# EAGLE design RFID (EAGLE 6.4)
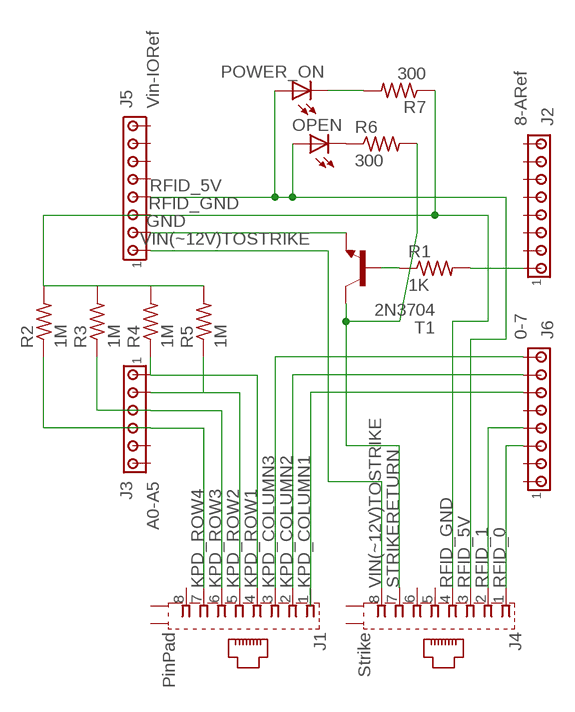
[diagram p0: schematic, sheet 1]

## Parts
J1  PinPad  556591-1  [556591-1]
J2  8-ARef  MTA08-156  [1X8MTA]
J3  A0-A5  MTA06-100  [10X06MTA]
J4  Strike  556591-1  [556591-1]
J5  Vin-IORef  MTA08-156  [1X8MTA]
J6  0-7  MTA08-156  [1X8MTA]
OPEN  LED3MM  [LED3MM]
POWER_ON  LED3MM  [LED3MM]
R1  1K  R-US_0204/5  [0204/5]
R2  1M  R-US_0204/5  [0204/5]
R3  1M  R-US_0204/5  [0204/5]
R4  1M  R-US_0204/5  [0204/5]
R5  1M  R-US_0204/5  [0204/5]
R6  300  R-US_0204/5  [0204/5]
R7  300  R-US_0204/5  [0204/5]
T1  2N3704  [TO92]

## Nets
GND: J5.2 T1.3(E)
KPD_COLUMN1: J6.6
KPD_COLUMN2: J1.2 J6.7
KPD_COLUMN3: J1.3 J6.8
KPD_ROW1: J1.4 J3.6 R4.1
KPD_ROW2: J1.5 J3.5 R5.1
KPD_ROW3: J1.6 J3.4 R3.1
KPD_ROW4: J1.7 J3.3 R2.1
N$1: J2.1 R1.2
N$2: R1.1 T1.1(B)
N$3: OPEN.K(C) R6.1
N$4: POWER_ON.K(C) R7.2
RFID_0: J4.1 J6.3
RFID_1: J4.2 J6.4
RFID_5V: J4.3 J5.4 OPEN.A POWER_ON.A
RFID_GND: J4.4 J5.3 R2.2 R3.2 R4.2 R5.2 R7.1
STRIKERETURN: J4.7 R6.2 T1.2(C)
VIN(~12V)TOSTRIKE: J4.8 J5.1
Unconnected: J1.1 J1.8 J1.G1(S1) J1.G2(S2) J2.2 J2.3 J2.4 J2.5 J2.6 J2.7 J2.8 J3.1 J3.2 J4.5 J4.6 J4.G1(S1) J4.G2(S2) J5.5 J5.6 J5.7 J5.8 J6.1 J6.2 J6.5

## Library data of the parts
J1 J4 = con-amp:556591-1: AMP connector
J2 J5 J6 = con-amp:MTA08-156: AMP connector
J3 = con-amp:MTA06-100: AMP connector
OPEN POWER_ON = led:LED: LED OSRAM: - CHIPLED LG R971, LG N971, LY N971, LG Q971, LY Q971, LO R971, LY R971 LH N974, LH R974 LS Q976, LO Q976, LY Q976 LO Q996 - Hyper CHIPLED LW Q18S LB Q993, LB Q99A, LB R99A - SideLED LS A670, LO A670, LY A670, LG A670, LP A670 LB A673, LV A673, LT A673, LW A673 LH A674 LY A675 LS A676, LA A676, LO A676, LY A676, LW A676 LS A679, LY A679, LG A679 - Hyper Micro SIDELED® LS Y876, LA Y876, LO Y876, LY Y876 LT Y87S - SmartLED LW L88C, LW L88S LB L89C, LB L89S, LG L890 LS L89K, LO L89K, LY L89K LS L896, LA L896, LO L896, LY L896 - TOPLED LS T670, LO T670, LY T670, LG T670, LP T670 LSG T670, LSP T670, LSY T670, LOP T670, LYG T670 LG T671, LOG T671, LSG T671 LB T673, LV T673, LT T673, LW T673 LH T674 LS T676, LA T676, LO T676, LY T676, LB T676, LH T676, LSB T676, LW T676 LB T67C, LV T67C, LT T67C, LS T67K, LO T67K, LY T67K, LW E67C LS E67B, LA E67B, LO E67B, LY E67B, LB E67C, LV E67C, LT E67C LW T67C LS T679, LY T679, LG T679 LS T770, LO T770, LY T770, LG T770, LP T770 LB T773, LV T773, LT T773, LW T773 LH T774 LS E675, LA E675, LY E675, LS T675 LS T776, LA T776, LO T776, LY T776, LB T776 LHGB T686 LT T68C, LB T68C - Hyper Mini TOPLED® LB M676 - Mini TOPLED Santana® LG M470 LS M47K, LO M47K, LY M47K Source: http://www.osram.convergy.de LUXEON: - LUMILED® LXK2-PW12-R00, LXK2-PW12-S00, LXK2-PW14-U00, LXK2-PW14-V00 LXK2-PM12-R00, LXK2-PM12-S00, LXK2-PM14-U00 LXK2-PE12-Q00, LXK2-PE12-R00, LXK2-PE12-S00, LXK2-PE14-T00, LXK2-PE14-U00 LXK2-PB12-K00, LXK2-PB12-L00, LXK2-PB12-M00, LXK2-PB14-N00, LXK2-PB14-P00, LXK2-PB14-Q00 LXK2-PR12-L00, LXK2-PR12-M00, LXK2-PR14-Q00, LXK2-PR14-R00 LXK2-PD12-Q00, LXK2-PD12-R00, LXK2-PD12-S00 LXK2-PH12-R00, LXK2-PH12-S00 LXK2-PL12-P00, LXK2-PL12-Q00, LXK2-PL12-R00 Source: www.luxeon.com KINGBRIGHT: KA-3528ASYC Source: www.kingbright.com
R1-R7 = rcl:R-US_: RESISTOR, American symbol
T1 = transistor:2N3704: NPN TRANSISTOR

## Board
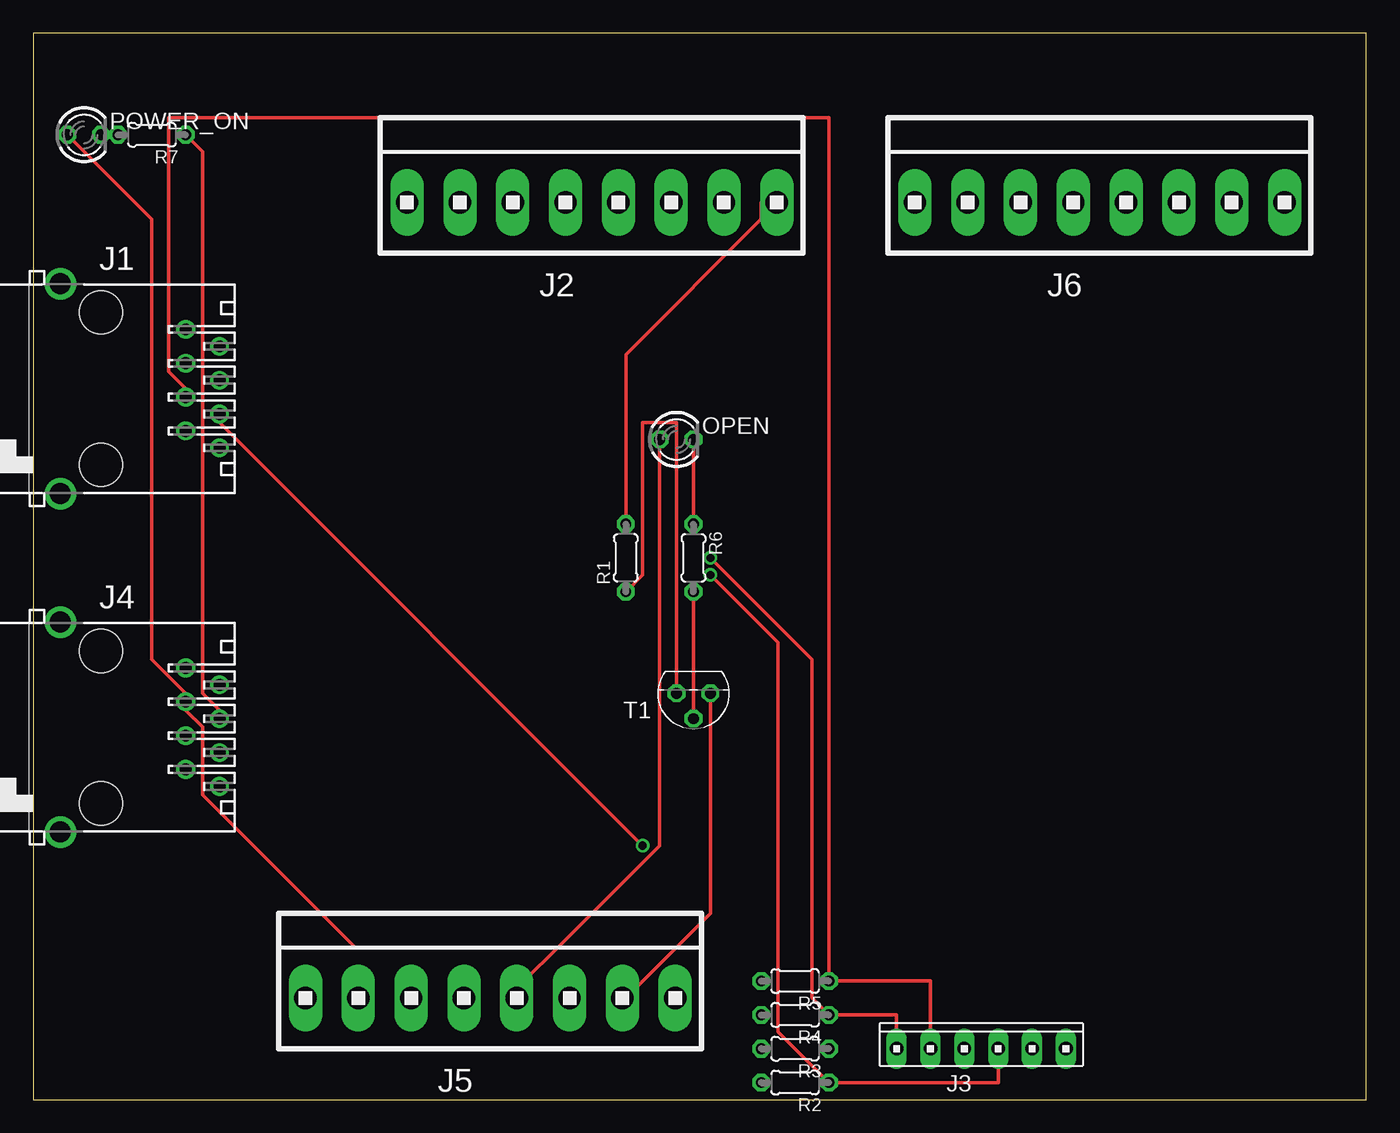
[diagram p1: board, top side]
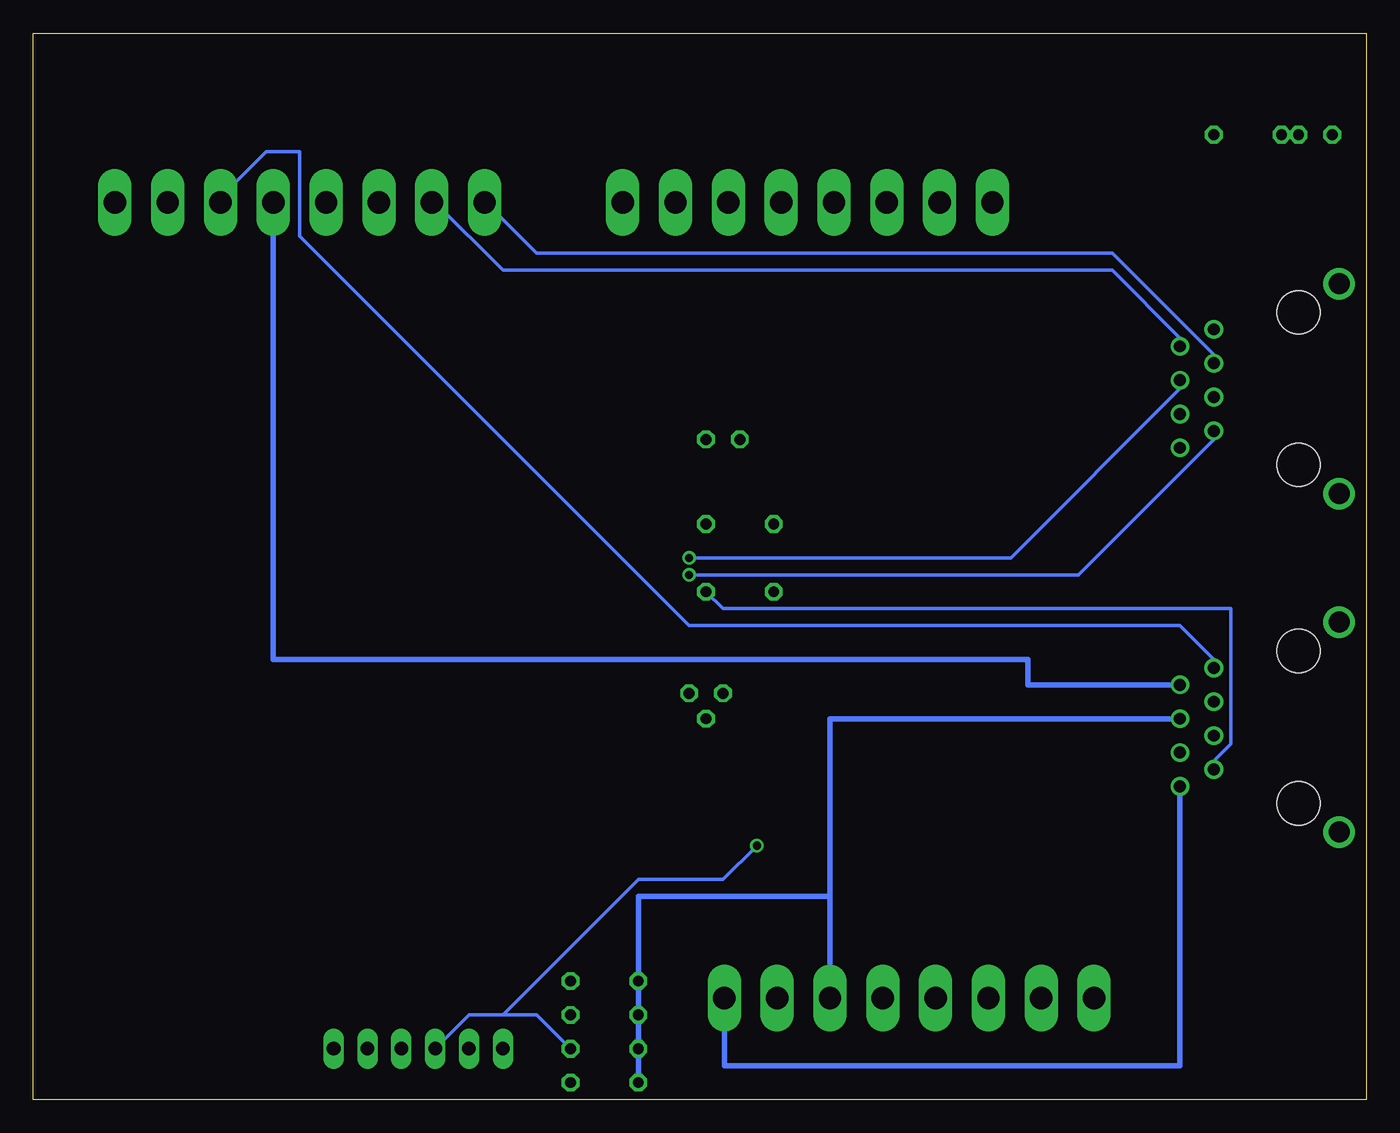
[diagram p2: board, bottom side, seen from below]

Size 100 x 80 mm. Coordinates in mm from the lower left corner, seen from the top.
Outline: 0,0 100,0 100,80 0,80 0,0
Copper layers (1*16): Top 0.035mm / dielectric 1.5mm / Bottom 0.035mm
Design rules "default": minimum track width 10mil, minimum drill 24mil, track to track 8mil, track to pad 8mil, pad to pad 8mil, via to via 8mil, smd to smd 8mil, copper to edge 40mil, drill to drill 8mil, minimum pad ring 10mil, minimum via ring 8mil, stop-mask expansion 4mil, vias tented up to drill 0mil, thermal gap 10mil

### Footprints (pad centres in the part's own frame; a part is rotated, then mirrored left to right if it is on the bottom)
556591-1 = drill 0.889: 1 -4.445,6.35; 2 -3.175,8.89; 3 -1.905,6.35; 4 -0.635,8.89; 5 0.635,6.35; 6 1.905,8.89; 7 3.175,6.35; 8 4.445,8.89 | drill 1.575 pad 2.184: G1 -7.874,-3.048; G2 7.874,-3.048 | hole 3.251: -5.715,0; 5.715,0
1X8MTA = drill 1.676 long: 1 13.868,0; 2 9.906,0; 3 5.944,0; 4 1.981,0; 5 -1.981,0; 6 -5.944,0; 7 -9.906,0; 8 -13.868,0
10X06MTA = drill 1.016 long: 1 6.35,0; 2 3.81,0; 3 1.27,0; 4 -1.27,0; 5 -3.81,0; 6 -6.35,0
LED3MM = drill 0.813 octagon: A -1.27,0; K 1.27,0
0204/5 = drill 0.813 octagon: 1 -2.54,0; 2 2.54,0
TO92 = drill 0.813 octagon: 1 1.27,0; 2 0,1.905; 3 -1.27,0

### Placement (x,y rotation side)
J1  5.08,53.34 270 top
J2  41.91,67.31 0 top
J3  71.12,3.81 0 top
J4  5.08,27.94 270 top
J5  34.29,7.62 0 top
J6  80.01,67.31 0 top
OPEN  48.26,49.53 0 top
POWER_ON  3.81,72.39 0 top
R1  44.45,40.64 90 top
R2  57.15,1.27 180 top
R3  57.15,3.81 180 top
R4  57.15,6.35 180 top
R5  57.15,8.89 180 top
R6  49.53,40.64 270 top
R7  8.89,72.39 180 top
T1  49.53,30.48 180 top

### Tracks (layer width: path | path; a pad name or v marks a point on that pad's centre or on a via)
GND
  Top 0.254: T1.3 50.8,13.97 44.45,7.62 J5.2
KPD_COLUMN2
  Bottom 0.254: J1.2 13.97,57.15 19.05,62.23 64.77,62.23 69.85,67.31 J6.7
KPD_COLUMN3
  Bottom 0.254: J1.3 11.43,55.88 19.05,63.5 62.23,63.5 66.04,67.31 J6.8
KPD_ROW1  (via drill 0.61)
  Top 0.254: J3.6 64.77,6.35 R4.1 58.42,7.62 58.42,33.02 v50.8,40.64
  Bottom 0.254: v50.8,40.64 26.67,40.64 13.97,53.34 J1.4
KPD_ROW2
  Top 0.254: J3.5 67.31,8.89 R5.1 59.69,73.66 10.16,73.66 10.16,54.61 11.43,53.34 J1.5
KPD_ROW3  (via drill 0.61)
  Top 0.254: v45.72,19.05 13.97,50.8 J1.6
  Bottom 0.254: R3.1 62.23,6.35 64.77,6.35 | 64.77,6.35 67.31,6.35 J3.4 | v45.72,19.05 48.26,16.51 54.61,16.51 64.77,6.35
KPD_ROW4  (via drill 0.61)
  Top 0.254: J3.3 72.39,1.27 R2.1 55.88,5.08 55.88,34.29 v50.8,39.37
  Bottom 0.254: v50.8,39.37 21.59,39.37 11.43,49.53 J1.7
N$1
  Top 0.254: R1.2 44.45,55.88 54.61,66.04 54.61,67.31 J2.1
N$2
  Top 0.254: T1.1 48.26,50.8 45.72,50.8 45.72,39.37 R1.1
N$3
  Top 0.254: OPEN.K R6.1
N$4
  Bottom 0.406: POWER_ON.K R7.2
RFID_0
  Bottom 0.254: J4.1 11.43,33.02 13.97,35.56 50.8,35.56 80.01,64.77 80.01,71.12 82.55,71.12 86.36,67.31 J6.3
RFID_1
  Bottom 0.406: J4.2 25.4,31.11 25.4,33.02 81.99,33.02 J6.4
RFID_5V
  Top 0.254: POWER_ON.A 8.89,66.04 8.89,33.02 11.43,30.48 J4.3 11.43,29.21 12.7,27.94 12.7,22.86 24.13,11.43 39.37,11.43 | OPEN.A 46.99,19.05 39.37,11.43 | 39.37,11.43 36.83,8.89 36.83,7.62 J5.4
RFID_GND
  Top 0.254: R7.1 12.7,71.12 12.7,30.48 13.97,29.21 J4.4
  Bottom 0.406: J4.4 40.23,28.57 J5.3 40.23,15.24 54.61,15.24 R5.2 R4.2 R3.2 R2.2
STRIKERETURN
  Top 0.254: R6.2 T1.2
  Bottom 0.254: R6.2 48.26,36.83 10.16,36.83 10.16,26.67 11.43,25.4 J4.7
VIN(~12V)TOSTRIKE
  Bottom 0.406: J4.8 13.97,2.54 48.16,2.54 J5.1